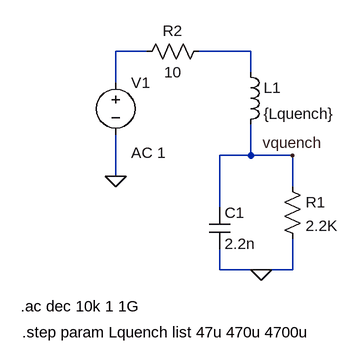
[diagram p0: schematic quench-freq.asc]
quench-freq.asc, the LTspice schematic file:
Version 4
SHEET 1 880 680
WIRE 176 -32 128 -32
WIRE 336 -32 256 -32
WIRE 336 0 336 -32
WIRE 128 16 128 -32
WIRE 336 128 336 80
WIRE 336 128 288 128
WIRE 400 128 336 128
WIRE 128 160 128 96
WIRE 400 176 400 128
WIRE 288 208 288 128
WIRE 288 304 288 272
WIRE 352 304 288 304
WIRE 400 304 400 256
WIRE 400 304 352 304
FLAG 352 304 0
FLAG 400 128 vquench
FLAG 128 160 0
SYMBOL ind 320 -16 R0
SYMATTR InstName L1
SYMATTR Value {Lquench}
SYMBOL cap 272 208 R0
SYMATTR InstName C1
SYMATTR Value 2.2n
SYMBOL res 384 160 R0
SYMATTR InstName R1
SYMATTR Value 2.2K
SYMBOL voltage 128 0 R0
WINDOW 123 24 124 Left 2
WINDOW 39 0 0 Left 0
SYMATTR InstName V1
SYMATTR Value ""
SYMATTR Value2 AC 1
SYMBOL res 272 -48 R90
WINDOW 0 0 56 VBottom 2
WINDOW 3 32 56 VTop 2
SYMATTR InstName R2
SYMATTR Value 10
TEXT -18 360 Left 2 !.ac dec 10k 1 1G
TEXT -16 400 Left 2 !.step param Lquench list 47u 470u 4700u

The netlist it stands for:
* quench-freq.asc
L1 N002 vquench {Lquench}
C1 vquench 0 2.2n
R1 vquench 0 2.2K
V1 N001 0 AC 1
R2 N002 N001 10
.ac dec 10k 1 1G
.step param Lquench list 47u 470u 4700u
.backanno
.end